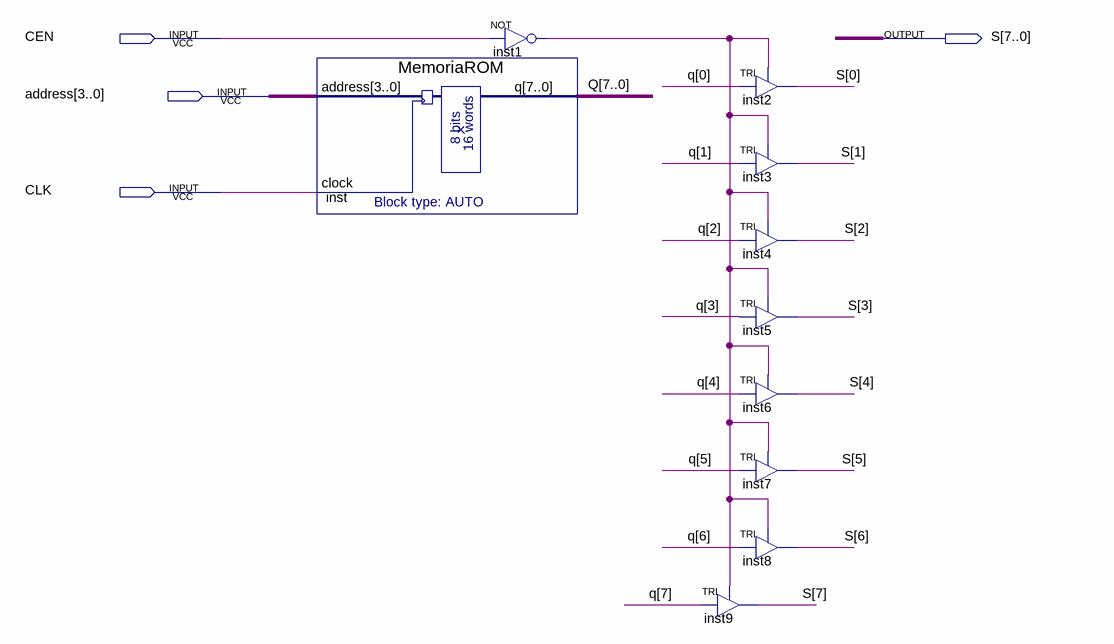
[diagram p0: schematic sheet]
// Quartus schematic Rom.bdf as structural Verilog: 10 symbols, 4 pins
module Rom (
  input  CEN,
  input  [3:0] address,
  input  CLK,
  output [7:0] S
);

  wire inst1_out;
  wire [7:0] Q;

  MemoriaROM inst (.address(address), .clock(CLK), .q(Q));
  not inst1 (inst1_out, CEN);
  TRI inst9 (.IN(Q[7]), .OE(inst1_out), .OUT(S[7]));
  TRI inst2 (.IN(Q[0]), .OE(inst1_out), .OUT(S[0]));
  TRI inst3 (.IN(Q[1]), .OE(inst1_out), .OUT(S[1]));
  TRI inst4 (.IN(Q[2]), .OE(inst1_out), .OUT(S[2]));
  TRI inst5 (.IN(Q[3]), .OE(inst1_out), .OUT(S[3]));
  TRI inst6 (.IN(Q[4]), .OE(inst1_out), .OUT(S[4]));
  TRI inst7 (.IN(Q[5]), .OE(inst1_out), .OUT(S[5]));
  TRI inst8 (.IN(Q[6]), .OE(inst1_out), .OUT(S[6]));
endmodule
